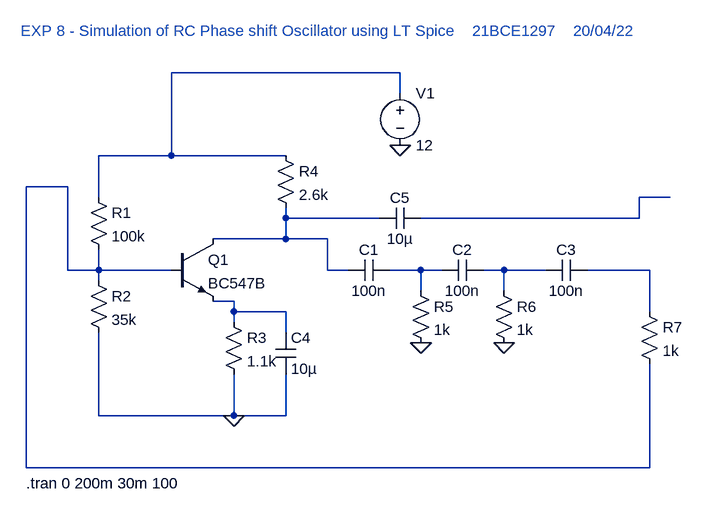
[diagram p0: schematic Exp8.asc]
Exp8.asc, the LTspice schematic file:
Version 4
SHEET 1 880 680
WIRE 384 -160 32 -160
WIRE 384 -128 384 -160
WIRE 32 -32 32 -160
WIRE 32 -32 -80 -32
WIRE 208 -32 32 -32
WIRE -128 16 -192 16
WIRE -80 32 -80 -32
WIRE 800 32 752 32
WIRE 208 64 208 48
WIRE 352 64 208 64
WIRE 752 64 752 32
WIRE 752 64 416 64
WIRE 208 96 208 64
WIRE 208 96 96 96
WIRE 272 96 208 96
WIRE -128 144 -128 16
WIRE -80 144 -80 112
WIRE -80 144 -128 144
WIRE 32 144 -80 144
WIRE 272 144 272 96
WIRE 304 144 272 144
WIRE 416 144 368 144
WIRE 448 144 416 144
WIRE 544 144 512 144
WIRE 608 144 544 144
WIRE 768 144 672 144
WIRE -80 160 -80 144
WIRE 416 176 416 144
WIRE 544 176 544 144
WIRE 128 192 96 192
WIRE 128 208 128 192
WIRE 208 208 128 208
WIRE 768 208 768 144
WIRE 128 224 128 208
WIRE 208 240 208 208
WIRE -80 368 -80 240
WIRE 128 368 128 304
WIRE 128 368 -80 368
WIRE 208 368 208 304
WIRE 208 368 128 368
WIRE -192 448 -192 16
WIRE 768 448 768 288
WIRE 768 448 -192 448
FLAG 384 -48 0
FLAG 128 368 0
FLAG 416 256 0
FLAG 544 256 0
SYMBOL npn 32 96 R0
SYMATTR InstName Q1
SYMATTR Value BC547B
SYMBOL res -96 16 R0
SYMATTR InstName R1
SYMATTR Value 100k
SYMBOL res -96 144 R0
SYMATTR InstName R2
SYMATTR Value 35k
SYMBOL res 112 208 R0
SYMATTR InstName R3
SYMATTR Value 1.1k
SYMBOL res 192 -48 R0
SYMATTR InstName R4
SYMATTR Value 2.6k
SYMBOL res 400 160 R0
SYMATTR InstName R5
SYMATTR Value 1k
SYMBOL res 528 160 R0
SYMATTR InstName R6
SYMATTR Value 1k
SYMBOL cap 368 128 R90
WINDOW 0 0 32 VBottom 2
WINDOW 3 32 32 VTop 2
SYMATTR InstName C1
SYMATTR Value 100n
SYMBOL cap 512 128 R90
WINDOW 0 0 32 VBottom 2
WINDOW 3 32 32 VTop 2
SYMATTR InstName C2
SYMATTR Value 100n
SYMBOL cap 672 128 R90
WINDOW 0 0 32 VBottom 2
WINDOW 3 32 32 VTop 2
SYMATTR InstName C3
SYMATTR Value 100n
SYMBOL res 752 192 R0
SYMATTR InstName R7
SYMATTR Value 1k
SYMBOL voltage 384 -144 R0
SYMATTR InstName V1
SYMATTR Value 12
SYMBOL cap 192 240 R0
SYMATTR InstName C4
SYMATTR Value 10µ
SYMBOL cap 416 48 R90
WINDOW 0 0 32 VBottom 2
WINDOW 3 32 32 VTop 2
SYMATTR InstName C5
SYMATTR Value 10µ
TEXT -200 -224 Left 2 ;EXP 8 - Simulation of RC Phase shift Oscillator using LT Spice    21BCE1297    20/04/22
TEXT -192 472 Left 2 !.tran 0 200m 30m 100

The netlist it stands for:
* Exp8.asc
Q1 N004 N002 N008 0 BC547B
R1 N001 N002 100k
R2 N002 0 35k
R3 N008 0 1.1k
R4 N001 N004 2.6k
R5 N005 0 1k
R6 N006 0 1k
C1 N005 N004 100n
C2 N006 N005 100n
C3 N007 N006 100n
R7 N007 N002 1k
V1 N001 0 12
C4 N008 0 10µ
C5 N003 N004 10µ
.model NPN NPN
.model PNP PNP
.lib standard.bjt
* EXP 8 - Simulation of RC Phase shift Oscillator using LT Spice    21BCE1297    20/04/22
.tran 0 200m 30m 100
.backanno
.end